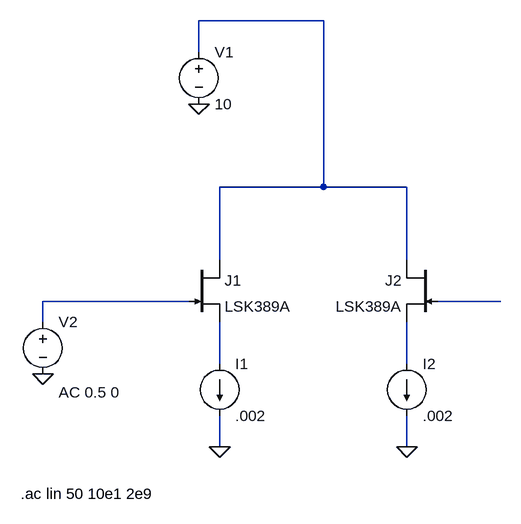
[diagram p0: schematic Draft8.asc]
Draft8.asc, the LTspice schematic file:
Version 4
SHEET 1 880 680
WIRE 256 -240 64 -240
WIRE 64 -192 64 -240
WIRE 256 16 256 -240
WIRE 256 16 96 16
WIRE 384 16 256 16
WIRE 96 128 96 16
WIRE 384 128 384 16
WIRE 48 192 -176 192
WIRE 528 192 432 192
WIRE -176 224 -176 192
WIRE 96 288 96 224
WIRE 384 288 384 224
WIRE 96 416 96 368
WIRE 384 416 384 368
FLAG 96 416 0
FLAG 64 -112 0
FLAG -176 304 0
FLAG 384 416 0
SYMBOL njf 48 128 R0
SYMATTR InstName J1
SYMATTR Value LSK389A
SYMBOL njf 432 128 M0
SYMATTR InstName J2
SYMATTR Value LSK389A
SYMBOL current 96 288 R0
WINDOW 123 0 0 Left 0
WINDOW 39 0 0 Left 0
SYMATTR InstName I1
SYMATTR Value .002
SYMBOL voltage 64 -208 R0
WINDOW 123 0 0 Left 0
WINDOW 39 0 0 Left 0
SYMATTR InstName V1
SYMATTR Value 10
SYMBOL voltage -176 208 R0
WINDOW 123 24 124 Left 2
WINDOW 39 0 0 Left 0
SYMATTR InstName V2
SYMATTR Value ""
SYMATTR Value2 AC 0.5 0
SYMBOL current 384 288 R0
WINDOW 123 0 0 Left 0
WINDOW 39 0 0 Left 0
SYMATTR InstName I2
SYMATTR Value .002
TEXT -210 488 Left 2 !.ac lin 50 10e1 2e9

The netlist it stands for:
* Draft8.asc
J1 N001 N002 N004 LSK389A
J2 N001 N003 N005 LSK389A
I1 N004 0 .002
V1 N001 0 10
V2 N002 0 AC 0.5 0
I2 N005 0 .002
.model NJF NJF
.model PJF PJF
.lib standard.jft
.ac lin 50 10e1 2e9
.backanno
.end